# Altium schematic sheet STM32F030.SchDoc
size A4
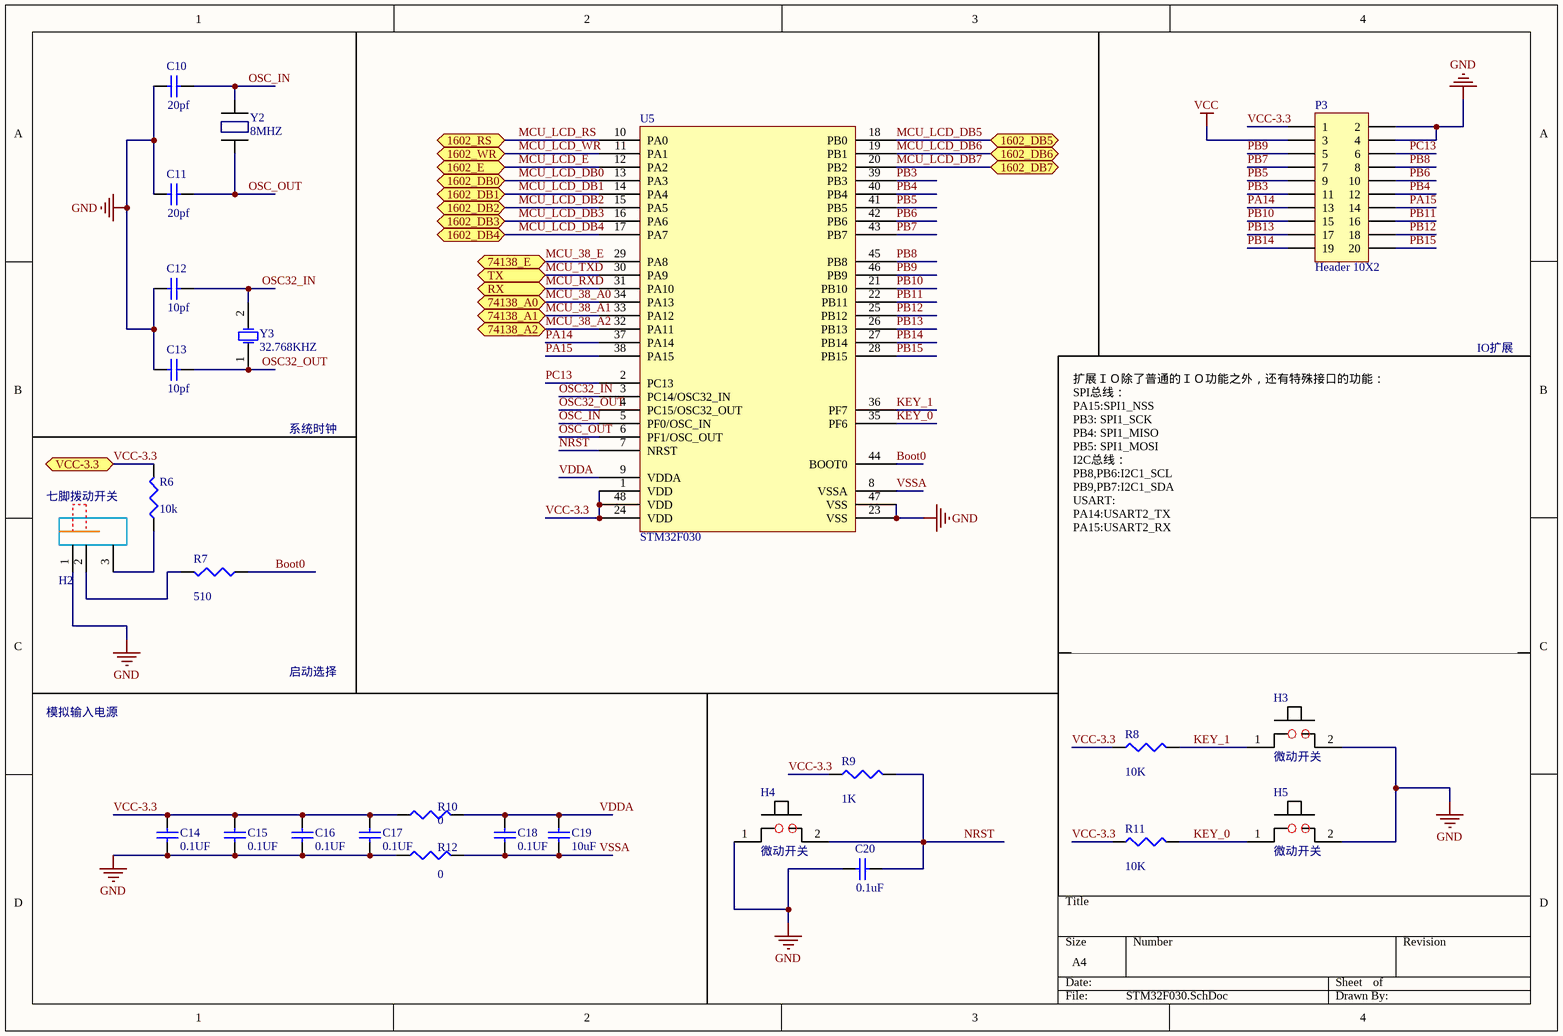
[diagram p0: STM32F030.SchDoc]

## Parts
C10  value 20pf  [C1206]  (hidden comment: Cap Semi)
C11  value 20pf  [C1206]  (hidden comment: Cap Semi)
C12  value 10pf  [C1206]  (hidden comment: Cap Semi)
C13  value 10pf  [C1206]  (hidden comment: Cap Semi)
C14  value 0.1UF  [C1206]  (hidden comment: Cap Semi)
C15  value 0.1UF  [C1206]  (hidden comment: Cap Semi)
C16  value 0.1UF  [C1206]  (hidden comment: Cap Semi)
C17  value 0.1UF  [C1206]  (hidden comment: Cap Semi)
C18  value 0.1UF  [C1206]  (hidden comment: Cap Semi)
C19  value 10uF  [C1206]  (hidden comment: Cap Semi)
C20  value 0.1uF  [C1206]  (hidden comment: Cap Semi)
H2  七脚拨动开关  [七脚拨动开关]
H3  微动开关  [微动开关]
H4  微动开关  [微动开关]
H5  微动开关  [微动开关]
P3  Header 10X2  [HDR2X10]
R6  value 10k  [14-1210]  (hidden comment: Res3)
R7  value 510  [14-1210]  (hidden comment: Res3)
R8  value 10K  [14-1210]  (hidden comment: Res3)
R9  value 1K  [14-1210]  (hidden comment: Res3)
R10  value 0  [14-1210]  (hidden comment: Res3)
R11  value 10K  [14-1210]  (hidden comment: Res3)
R12  value 0  [14-1210]  (hidden comment: Res3)
U5  STM32F030  [TSQFP50P900X900X160-48N]
Y2  8MHZ  [晶振]
Y3  32.768KHZ  [R38]

## Ports
1602_DB0, 1602_DB1, 1602_DB2, 1602_DB3, 1602_DB4, 1602_DB5, 1602_DB6, 1602_DB7, 1602_E, 1602_RS, 1602_WR, 74138_A0, 74138_A1, 74138_A2, 74138_E, RX, TX, VCC-3.3

## Nets
GND: C10.1 C11.1 C12.1 C13.1 C14.1 C15.1 C16.1 C17.1 C20.1 H2.1 H3.2 H4.1 H5.2 P3.2 P3.4 R12.1 U5.23(VSS) U5.47(VSS)
VCC: P3.3
Boot0: R7.1 U5.44(BOOT0)
KEY_0: H5.1 R11.2 U5.35(PF6)
KEY_1: H3.1 R8.2 U5.36(PF7)
MCU_38_A0: U5.34(PA13) ; port 74138_A0
MCU_38_A1: U5.33(PA12) ; port 74138_A1
MCU_38_A2: U5.32(PA11) ; port 74138_A2
MCU_38_E: U5.29(PA8) ; port 74138_E
MCU_LCD_DB0: U5.13(PA3) ; port 1602_DB0
MCU_LCD_DB1: U5.14(PA4) ; port 1602_DB1
MCU_LCD_DB2: U5.15(PA5) ; port 1602_DB2
MCU_LCD_DB3: U5.16(PA6) ; port 1602_DB3
MCU_LCD_DB4: U5.17(PA7) ; port 1602_DB4
MCU_LCD_DB5: U5.18(PB0) ; port 1602_DB5
MCU_LCD_DB6: U5.19(PB1) ; port 1602_DB6
MCU_LCD_DB7: U5.20(PB2) ; port 1602_DB7
MCU_LCD_E: U5.12(PA2) ; port 1602_E
MCU_LCD_RS: U5.10(PA0) ; port 1602_RS
MCU_LCD_WR: U5.11(PA1) ; port 1602_WR
MCU_RXD: U5.31(PA10) ; port RX
MCU_TXD: U5.30(PA9) ; port TX
NRST: C20.2 H4.2 R9.2 U5.7(NRST)
OSC32_IN: C12.2 U5.3(PC14/OSC32_IN) Y3.2(OSC2)
OSC32_OUT: C13.2 U5.4(PC15/OSC32_OUT) Y3.1(OSC1)
OSC_IN: C10.2 U5.5(PF0/OSC_IN) Y2.2
OSC_OUT: C11.2 U5.6(PF1/OSC_OUT) Y2.1
PA14: P3.13 U5.37(PA14)
PA15: P3.14 U5.38(PA15)
PB3: P3.11 U5.39(PB3)
PB4: P3.12 U5.40(PB4)
PB5: P3.9 U5.41(PB5)
PB6: P3.10 U5.42(PB6)
PB7: P3.7 U5.43(PB7)
PB8: P3.8 U5.45(PB8)
PB9: P3.5 U5.46(PB9)
PB10: P3.15 U5.21(PB10)
PB11: P3.16 U5.22(PB11)
PB12: P3.18 U5.25(PB12)
PB13: P3.17 U5.26(PB13)
PB14: P3.19 U5.27(PB14)
PB15: P3.20 U5.28(PB15)
PC13: P3.6 U5.2(PC13)
VCC-3.3: C14.2 C15.2 C16.2 C17.2 P3.1 R6.2 R8.1 R9.1 R10.1 R11.1 U5.1(VDD) U5.24(VDD) U5.48(VDD) ; port VCC-3.3
VDDA: C18.2 C19.2 R10.2 U5.9(VDDA)
VSSA: C18.1 C19.1 R12.2 U5.8(VSSA)
NetH2_2: H2.2 R7.2
NetH2_3: H2.3 R6.1

## Notes on the sheet
- IO扩展
- 系统时钟
- 扩展ＩＯ除了普通的ＩＯ功能之外，还有特殊接口的功能：
  SPI总线：
  PA15:SPI1_NSS
  PB3: SPI1_SCK
  PB4: SPI1_MISO
  PB5: SPI1_MOSI
  I2C总线：
  PB8,PB6:I2C1_SCL
  PB9,PB7:I2C1_SDA
  USART:
  PA14:USART2_TX
  PA15:USART2_RX
- 模拟输入电源
- 启动选择

## Library data of the parts
C10-C20 = Cap Semi: Capacitor (Semiconductor SIM Model); Published: 8-Jun-2000; LatestRevisionDate: 29-May-2009; LatestRevisionNote: IPC-7351 Footprint Added.; PackageReference: C1206; Publisher: Altium Limited; PackageDescription: Chip Capacitor
H2 = 七脚拨动开关: H?
H3-H5 = 微动开关: H?
P3 = Header 10X2: Header, 10-Pin, Dual row; LatestRevisionDate: 17-Jul-2002; LatestRevisionNote: Re-released for DXP Platform.; Publisher: Altium Limited
R6-R12 = Res3: Resistor; Published: 8-Jun-2000; LatestRevisionDate: 29-May-2009; LatestRevisionNote: IPC-7351 Footprint Added.; PackageReference: J1-0603; Publisher: Altium Limited; PackageDescription: Chip Resistor
U5 = STM32F030C8T6: U?
Y2 = 晶振: Y?
Y3 = XTAL: Crystal Oscillator; Published: 8-Jun-2000; LatestRevisionDate: 17-Jul-2002; LatestRevisionNote: Re-released for DXP Platform.; PackageReference: R38; Publisher: Altium Limited; PackageDescription: Crystal, Thru-Hole; 2 Leads; Body 3.1 x 8.2 mm (Dia.xH)